# EAGLE design SPACE_v2.2_WEMOS_D1R2 (EAGLE 8.3.0)
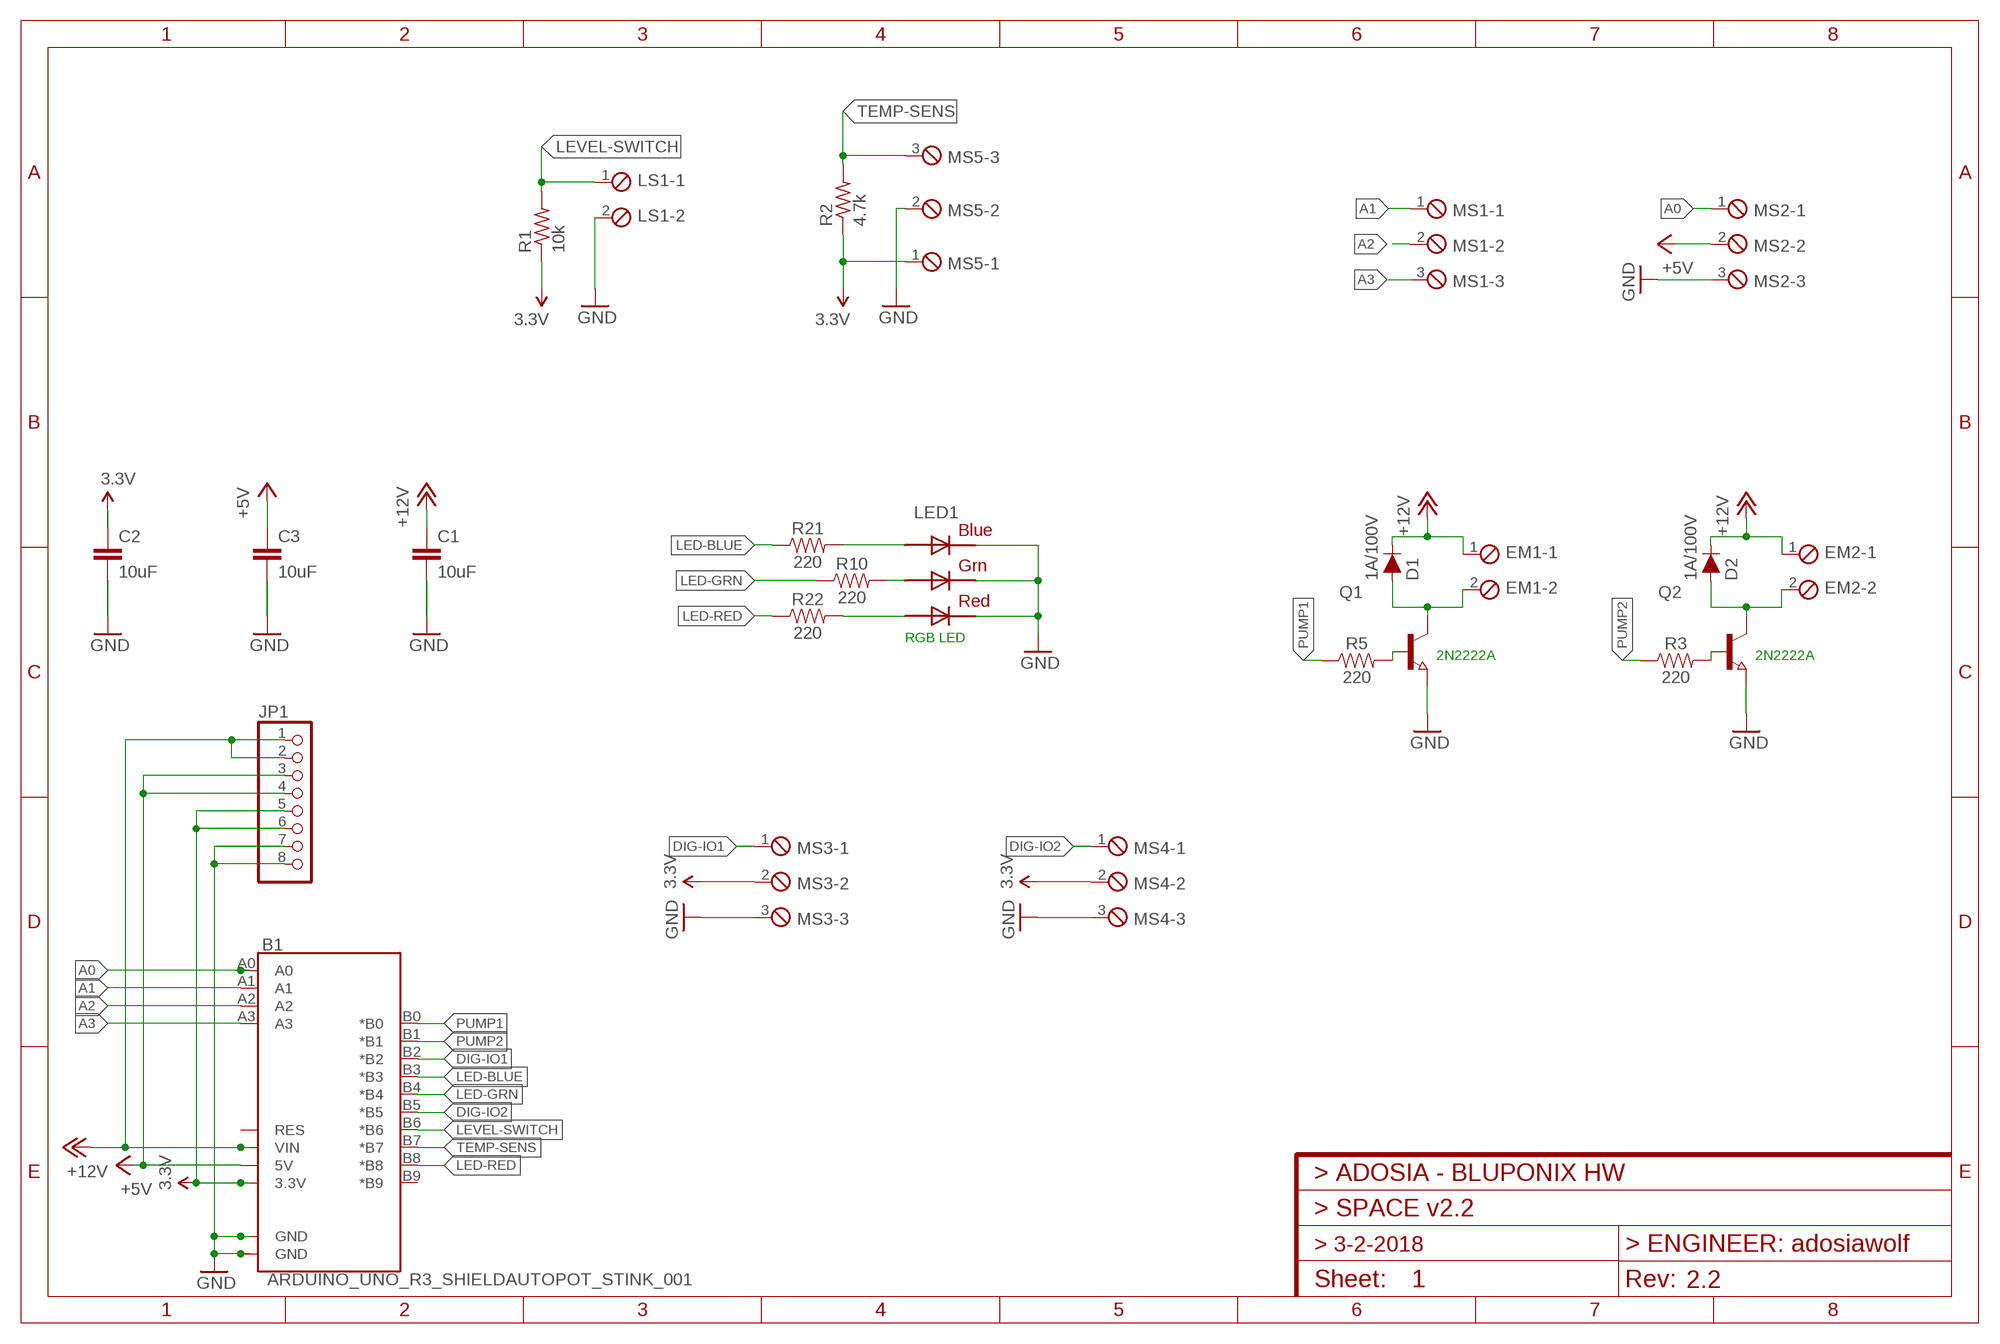
[diagram p0: schematic, sheet 1]

## Parts
B1  ARDUINO_UNO_R3_SHIELDAUTOPOT_STINK_001  [UNO_R3_SHIELD_LOCK]
C1  10uF  10UF-6.3V-20%(0603)  [0603-CAP@1]
C2  10uF  10UF-6.3V-20%(0603)  [0603-CAP@1]
C3  10uF  10UF-6.3V-20%(0603)  [0603-CAP@1]
D1  1A/100V  DIODE-BAS16J  [SOD-323]
D2  1A/100V  DIODE-BAS16J  [SOD-323]
EM1  MPT2  [2POL254]
EM2  MPT2  [2POL254]
JP1  PINHD-1X8/90  [1X08/90]
LED1  RGBLED5050  [RGBLED5050]
LS1  MPT2  [2POL254]
MS1  MPT3  [3POL254]
MS2  MPT3  [3POL254]
MS3  MPT3  [3POL254]
MS4  MPT3  [3POL254]
MS5  MPT3  [3POL254]
Q1  NPN-TRANSISTOR_SOT23  [SOT23]
Q2  NPN-TRANSISTOR_SOT23  [SOT23]
R1  10k  R-US_M1206  [M1206]
R2  4.7k  R-US_M1206  [M1206]
R3  220  220OHM-0603-1/10W-1%  [0603]
R5  220  220OHM-0603-1/10W-1%  [0603]
R10  220  220OHM-0603-1/10W-1%  [0603]
R21  220  220OHM-0603-1/10W-1%  [0603]
R22  220  220OHM-0603-1/10W-1%  [0603]

## Nets
3.3V: B1.3.3V C2.1 JP1.5 JP1.6 MS3.2 MS4.2 MS5.1 R1.1 R2.1
+5V: B1.5V C3.1 JP1.3 JP1.4 MS2.2
+12V: B1.VIN C1.1 D1.C D2.C EM1.1 EM2.1 JP1.1 JP1.2
A0: B1.A0 MS2.1
A1: B1.A1 MS1.1
A2: B1.A2 MS1.2
A3: B1.A3 MS1.3
DIG-IO1: B1.B2(*B2) MS3.1
DIG-IO2: B1.B5(*B5) MS4.1
GND: B1.GND@0(GND) B1.GND@1(GND) C1.2 C2.2 C3.2 JP1.7 JP1.8 LED1.4(BLUE_C) LED1.5(RED_C) LED1.6(GREEN_C) LS1.2 MS2.3 MS3.3 MS4.3 MS5.2 Q1.2(E) Q2.2(E)
LED-BLUE: B1.B3(*B3) R21.1
LED-GRN: B1.B4(*B4) R10.1
LED-RED: B1.B8(*B8) R22.1
LEVEL-SWITCH: B1.B6(*B6) LS1.1 R1.2
N$1: LED1.3(BLUE_A) R21.2
N$2: Q2.1(B) R3.2
N$3: Q1.1(B) R5.2
N$4: D2.A EM2.2 Q2.3(C)
N$6: D1.A EM1.2 Q1.3(C)
N$11: LED1.2(RED_A) R22.2
N$16: LED1.1(GREEN_A) R10.2
PUMP1: B1.B0(*B0) R5.1
PUMP2: B1.B1(*B1) R3.1
TEMP-SENS: B1.B7(*B7) MS5.3 R2.2
Unconnected: B1.B9(*B9) B1.RES

## Notes on the sheet
- RGB LED
- 2N2222A | 2N2222A

## Library data of the parts
B1 = SparkFun-Boards:ARDUINO_UNO_R3_SHIELD: Arduino R3 Shield Footprint Shield form compatible with the Arduino Uno R3. SparkFun Products: MG2639 Cellular Shield <https://www.sparkfun.com/products/13120> MIDI Shield <https://www.sparkfun.com/products/12898> R3 Stackable Headers Kit <https://www.sparkfun.com/products/11417>
C1-C3 = SparkFun-Capacitors:10UF-6.3V-20%(0603): CAP-11015; PROD_ID: CAP-11015
D1 D2 = SparkFun-DiscreteSemi:DIODE: Diode These are standard reverse protection diodes and small signal diodes. SparkFun Products: SparkFun SparkPunk Sound Kit <https://www.sparkfun.com/products/11177> SparkFun ESP8266 Thing <https://www.sparkfun.com/products/13231>; PROD_ID: DIO-09646; VALUE: 250mA/100V
EM1 EM2 LS1 = con-phoenix-254:MPT2: PHOENIX CONNECTOR; OC_FARNELL: unknown; OC_NEWARK: unknown
JP1 = pinhead:PINHD-1X8: PIN HEADER
LED1 = adafruit:RGBLED: For 5050 RGB LEDs, the order of the LEDs may vary from one manufacturer to another!
MS1-MS5 = con-phoenix-254:MPT3: PHOENIX CONNECTOR; OC_FARNELL: unknown; OC_NEWARK: unknown
Q1 Q2 = semicon-smd-ipc:NPN-TRANSISTOR_: NPN TRANSISTOR
R1 R2 = resistor:R-US_: RESISTOR, American symbol
R3 R5 R10 R21 R22 = SparkFun-Resistors:220OHM: 220Ω resistor A resistor is a passive two-terminal electrical component that implements electrical resistance as a circuit element. Resistors act to reduce current flow, and, at the same time, act to lower voltage levels within circuits. - Wikipedia; PROD_ID: RES-07861

## Board
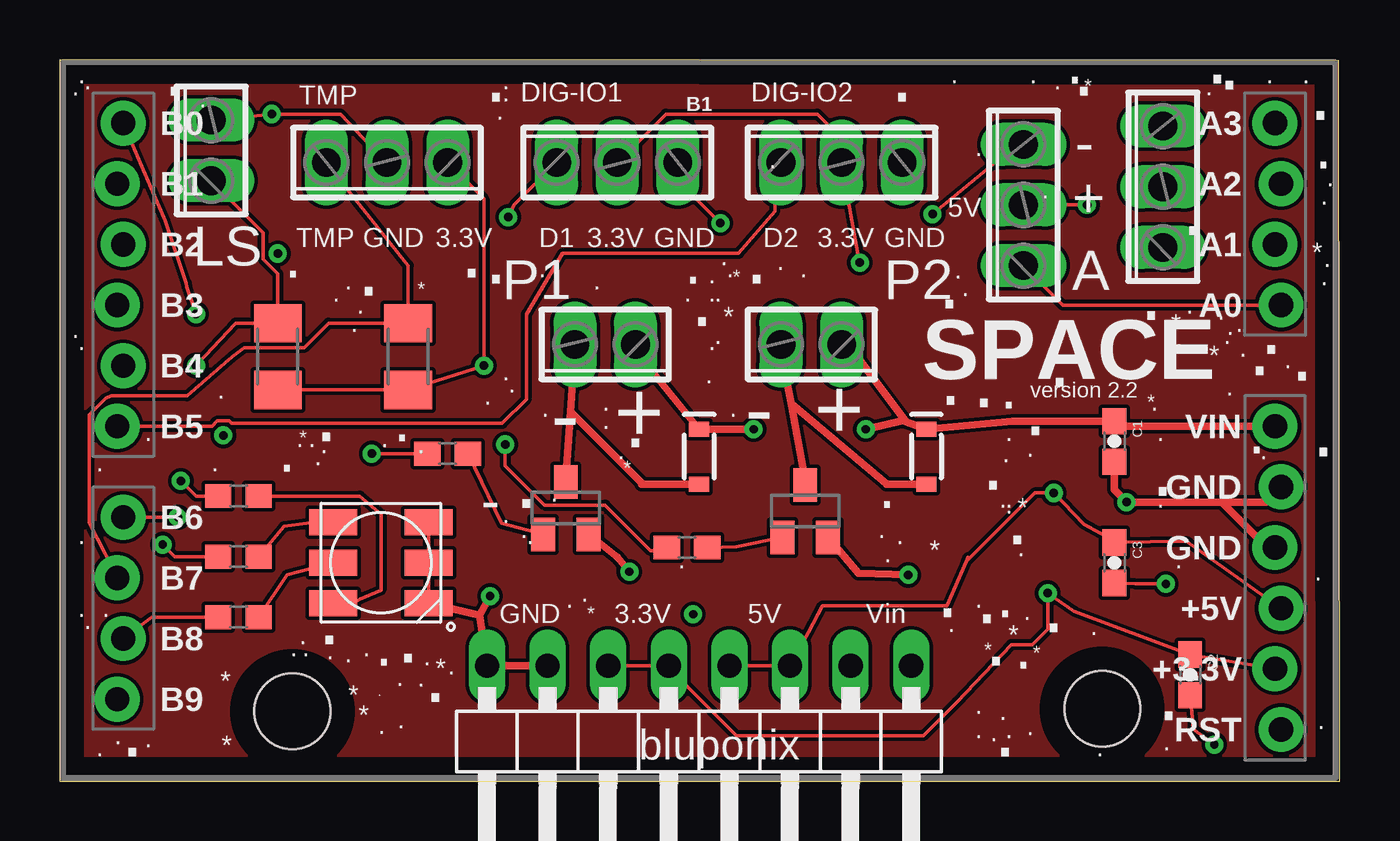
[diagram p1: board, top side]
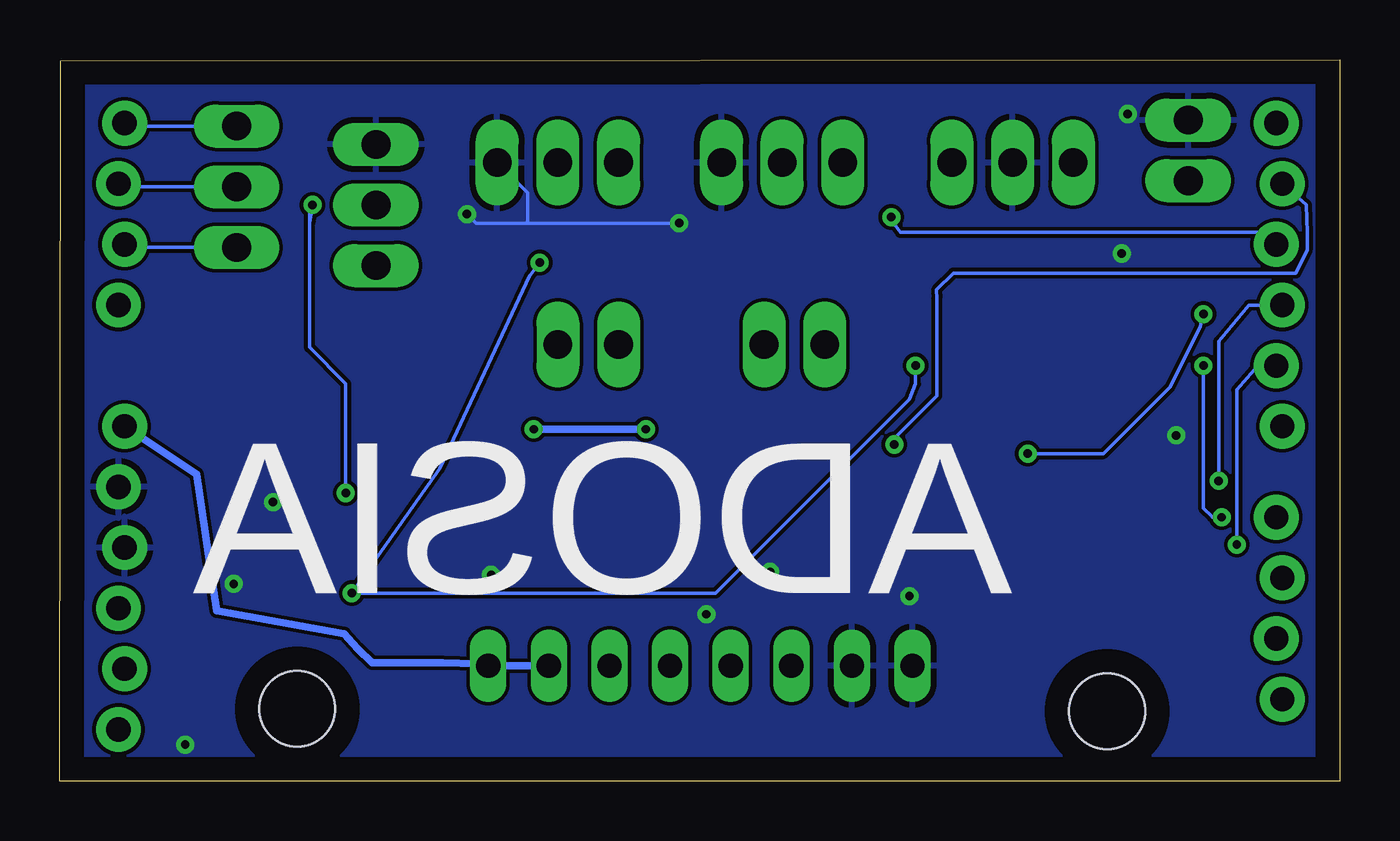
[diagram p2: board, bottom side, seen from below]

Size 53.65 x 30.22 mm. Coordinates in mm from the lower left corner, seen from the top.
Outline: 0,0 53.65,0 53.59,30.16 0,30.22 0,0
Copper layers (1*16): Top 0.035mm / dielectric 1.5mm / Bottom 0.035mm
Design rules "default": minimum track width 6mil, minimum drill 0.35mm, track to track 6mil, track to pad 6mil, pad to pad 6mil, via to via 6mil, smd to smd 6mil, copper to edge 40mil, drill to drill 6mil, minimum pad ring 10mil, minimum via ring 8mil, stop-mask expansion 4mil, vias tented up to drill 0mil, thermal gap 10mil
Holes 3.17 mm at 9.75,2.92 43.69,3.02

### Footprints (pad centres in the part's own frame; a part is rotated, then mirrored left to right if it is on the bottom)
UNO_R3_SHIELD_LOCK = drill 1.016 pad 1.88: 3.3V 24.13,-3.81; 5V 24.384,-1.27; A0 24.384,11.43; A1 24.13,13.97; A2 24.384,16.51; A3 24.13,19.05; B0 -24.13,19.05; B1 -24.384,16.51; B2 -24.13,13.97; B3 -24.384,11.43; B4 -24.13,8.89; B5 -24.384,6.35; B6 -24.13,2.54; B7 -24.384,0; B8 -24.13,-2.54; B9 -24.384,-5.08; GND@0 24.13,1.27; GND@1 24.384,3.81; RES 24.384,-6.35; VIN 24.13,6.35
0603-CAP@1 = smd 1.1 x 1: 1 -0.85,0; 2 0.85,0
SOD-323 = smd 0.63 x 0.83: A 1.15,0; C -1.15,0
2POL254 = drill 1.2 long: 1 -1.27,0; 2 1.27,0
1X08/90 = drill 1.016 long: 1 -8.89,-3.81; 2 -6.35,-3.81; 3 -3.81,-3.81; 4 -1.27,-3.81; 5 1.27,-3.81; 6 3.81,-3.81; 7 6.35,-3.81; 8 8.89,-3.81
RGBLED5050 = smd 2 x 1.1: 1 -2,1.7; 2 -2,0; 3 -2,-1.7; 4 2,-1.7; 5 2,0; 6 2,1.7
3POL254 = drill 1.2 long: 1 -2.54,0; 2 0,0; 3 2.54,0
SOT23 = smd 1 x 1.4: 1 -0.95,-1.1; 2 0.95,-1.1; 3 0,1.1
M1206 = smd 1.6 x 2: 1 -1.4,0; 2 1.4,0
0603 = smd 1.1 x 1: 1 -0.85,0; 2 0.85,0

### Placement (x,y rotation side)
B1  26.8,8.51 0 top
C1  44.2,14.22 270 top
C2  47.37,4.45 270 top
C3  44.2,9.14 270 top
D1  26.8,13.59 270 top
D2  36.32,13.59 270 top
EM1  22.86,18.29 180 top
EM2  31.5,18.29 180 top
JP1  26.8,1.02 180 top
LED1  13.46,9.14 0 top
LS1  6.35,26.42 90 top
MS1  46.23,24.89 90 top
MS2  40.39,24.13 90 top
MS3  23.37,25.91 0 top
MS4  32.77,25.91 0 top
MS5  13.72,25.91 180 top
Q1  21.21,11.43 0 top
Q2  31.24,11.3 0 top
R1  9.14,17.78 90 top
R2  14.61,17.78 90 top
R3  26.29,9.78 0 top
R5  16.26,13.72 0 top
R10  7.49,9.4 0 top
R21  7.49,11.94 0 top
R22  7.49,6.86 0 top

### Tracks (layer width: path | path; a pad name or v marks a point on that pad's centre or on a via)
3.3V  (via drill 0.35)
  Top 0.152: R1.1 R2.1 v17.78,17.4 17.78,24.38 MS5.1 | B1.3.3V C2.1 42.51,7.11 v41.4,7.87 41.4,6.35 40.77,5.71 39.88,5.71 37.59,3.3 36.2,1.91 28.36,1.91 25.44,4.83 | 23.37,25.65 MS3.2 25.4,27.94 31.75,27.94 32.51,27.18 32.51,26.16 MS4.2 33.53,21.59 v33.53,21.72 | 25.44,4.83 JP1.6 | 25.44,4.83 JP1.5
  Bottom 0.152: v41.4,7.87 26.16,7.87 18.03,16 17.78,16.64 v17.78,17.4 | v41.4,7.87 41.4,8.13 | v41.4,7.87 37.72,13.08 33.96,21.16 33.91,21.21 v33.53,21.72
+5V  (via drill 0.35)
  Top 0.152: B1.5V 47.2,10.03 C3.1 44.06,10.13 42.93,10.76 v41.66,12.06 40.86,12.06 37.99,9.2 | v43.05,24.13 MS2.2 | JP1.4 JP1.3 31.37,6.23 31.98,7.34 37.18,7.34 37.99,9.2 | 37.99,9.2 38.07,9.37
  Bottom 0.152: 43.18,23.37 v43.05,24.13 43.18,24 43.18,18.16 41.66,16.64 v41.66,12.06
+12V  (via drill 0.35)
  Top 0.152: 44.41,14.86 C1.1
  Top 0.305: B1.VIN 44.41,14.86 | EM1.1 24.01,18.17 D1.C 28.95,14.74 v29.08,14.73 | C1.1 39.92,15.07 D2.C 35.45,15.05 | 35.45,15.05 33.03,18.3 EM2.1 | v33.78,14.73 35.39,15.11 35.45,15.05
  Bottom 0.305: v29.08,14.73 v33.78,14.73 | B1.VIN 47.9,12.85 47.07,7.14 41.72,6.16 41.15,5.55 40.55,4.95 37.59,4.95 36.16,4.91 JP1.1 JP1.2
A0
  Top 0.152: MS2.1 42.04,19.94 B1.A0
A1
  Bottom 0.152: MS1.1 50.8,22.35 B1.A1
A2
  Bottom 0.152: MS1.2 51.05,24.89 B1.A2
A3
  Bottom 0.152: MS1.3 50.8,27.43 B1.A3
DIG-IO1  (via drill 0.35)
  Top 0.152: v18.8,23.62 19.05,24.13 MS3.1
  Bottom 0.152: v18.8,23.62 18.8,23.5 18.41,22.99 3.17,22.99 B1.B2
DIG-IO2
  Top 0.152: B1.B5 6.38,14.86 6.61,15.09 7.11,15.09 7.21,14.99 18.54,14.99 19.56,16 19.56,19.56 21.08,22.1 28.45,22.1 29.97,23.88 29.97,25.65 MS4.1
GND  (via drill 0.35)
  Top 0.152: MS5.2 13.67,25.91 11.77,27.94 9.02,27.94 v8.89,27.94 LS1.2 | C3.2 45.09,8.26 v46.35,8.26 | C2.2 47.5,2.16 v48.39,1.52 | MS3.3 25.91,25.15 v27.69,23.37 | MS2.3 40.13,26.67 v36.58,23.75 | LED1.6 LED1.5 LED1.4
  Top 0.305: Q1.2 23.37,9.38 v23.88,8.76 | Q2.2 33.46,8.7 v35.56,8.64 | 17.59,6.94 LED1.4 | 17.59,6.94 17.6,6.94 v18.03,7.75 | 17.59,6.94 17.8,5.71 JP1.8 JP1.7 | 48.7,11.68 v44.7,11.68 44.2,12.19 C1.2 | 48.7,11.68 50.55,11.68 B1.GND@1 | B1.GND@0 50.6,9.78 48.7,11.68
  Bottom 0.152: 27.69,23.5 v27.69,23.37 34.04,23.37 | v36.58,23.75 36.2,23.37 34.04,23.37 | 34.04,23.37 34.04,24.64 MS4.3
  other vias: 26.54,6.99 6.86,14.48 9.14,22.1
  pour Bottom: 0,30.23 0,0 53.59,0 53.59,30.23
LED-BLUE  (via drill 0.35)
  Top 0.152: R21.1 5.71,11.94 v5.08,12.57
  Bottom 0.152: B1.B3 3.81,19.94 5.08,18.41 v5.08,12.57
LED-GRN  (via drill 0.35)
  Top 0.152: R10.1 4.83,9.4 v4.32,9.91
  Bottom 0.152: B1.B4 3.43,17.4 4.32,16.38 v4.32,9.91
LED-RED
  Top 0.152: B1.B8 3.85,6.86 R22.1
LEVEL-SWITCH  (via drill 0.35)
  Top 0.152: LS1.1 8.54,22.96 8.54,21.85 9.14,21.24 R1.2 7.37,19.18 5.79,17.48 v5.71,17.41 v5.71,17.4 | v4.95,11.05 B1.B6
  Bottom 0.152: v5.71,17.4 5.71,11.43 5.34,11.06 | 5.34,11.06 5.33,11.05 | v4.95,11.05 5.33,11.05 | 5.33,11.05 5.34,11.06
N$1
  Top 0.152: R21.2 12.57,11.94 13.46,11.18 13.46,8 12.57,7.62 12.05,7.24 LED1.3
N$2
  Top 0.152: Q2.1 28.37,9.82 R3.2
N$3
  Top 0.152: R5.2 18.52,10.79 Q1.1
N$4
  Top 0.305: 30.65,15.86 31.24,12.53 31.34,12.43 Q2.3 | D2.A 34.65,12.44 34.65,12.45 30.8,15.69 | 30.8,15.69 30.66,15.8 | 30.65,15.86 30.27,17.73 EM2.2 | 30.65,15.86 30.65,15.83 30.8,15.69
N$5
  pour Top: 0,30.23 0,0 53.59,0 53.59,30.23
N$6
  Top 0.305: 21.4,15.47 21.21,12.56 Q1.3 | 21.4,15.47 EM1.2 | D1.A 24.38,12.44 24.38,12.5 21.4,15.47
N$11
  Top 0.152: R22.2 9.53,8.64 LED1.2
N$16
  Top 0.152: 8.51,9.4 R10.2 9.4,10.67 11.29,10.92 | 11.05,11.18 11.29,10.92 | 11.29,10.92 LED1.1
PUMP1  (via drill 0.35)
  Top 0.152: B1.B0 4.42,23.47 5.31,20.85 5.33,20.7 v5.71,19.56 | R5.1 v13.08,13.72
  Bottom 0.152: v13.08,13.72 9.91,13.72 7.11,16.51 5.84,19.05 v5.71,19.56
PUMP2  (via drill 0.35)
  Top 0.152: v18.67,14.1 18.67,13.21 20.32,11.56 22.86,11.56 24.77,9.65 25.31,9.65 R3.1
  Bottom 0.152: v18.67,14.1 18.67,14.35 16.89,16.13 16.89,20.19 16.89,20.57 16.2,21.27 1.84,21.27 1.37,22.25 1.37,22.96 1.4,24.13 B1.B1
TEMP-SENS
  Top 0.152: MS5.3 14.61,21.59 R2.2 11.27,19.18 10.24,18.15 7.74,18.15 7.24,17.78 5.33,16.13 2.16,16.13 1.93,16.03 1.25,15.34 1.25,10.82 1.91,9.52 B1.B7

### Text on the board
bPlace: ADOSIA
tNames: . | . | . | . | . | . | . | . | . | . | * | . | . | . | . | . | . | TMP | . | . | . | DIG-IO1 | DIG-IO2 | . | . | . | . | . | . | - | . | . | 5V | . | + | . | . | LS | TMP | GND | 3.3V | D1 | 3.3V | GND | . | D2 | 3.3V | GND | * | . | . | . | . | . | . | . | . | . | . | * | . | . | . | . | A | . | . | . | . | * | P1 | . | . | . | P2 | . | . | . | . | . | . | * | . | * | . | . | . | . | . | . | . | . | . | . | . | . | . | SPACE | . | * | . | . | . | . | . | . | . | . | . | version 2.2 | * | . | . | . | . | . | . | . | . | * | . | . | . | . | . | . | . | - | + | . | - | + | . | . | . | . | . | . | . | . | . | . | . | * | . | . | . | . | . | - | . | . | . | . | . | . | * | . | . | . | . | . | . | . | . | . | * | . | . | . | . | . | GND | . | . | * | 3.3V | 5V | Vin | . | . | . | . | . | . | . | . | . | * | . | . | . | . | . | . | . | . | . | . | * | . | . | * | * | . | . | . | * | . | * | . | . | . | . | . | * | . | . | . | . | . | . | . | . | . | . | * | . | . | .